# EAGLE design FuenteDePoder (EAGLE 8.6.3)
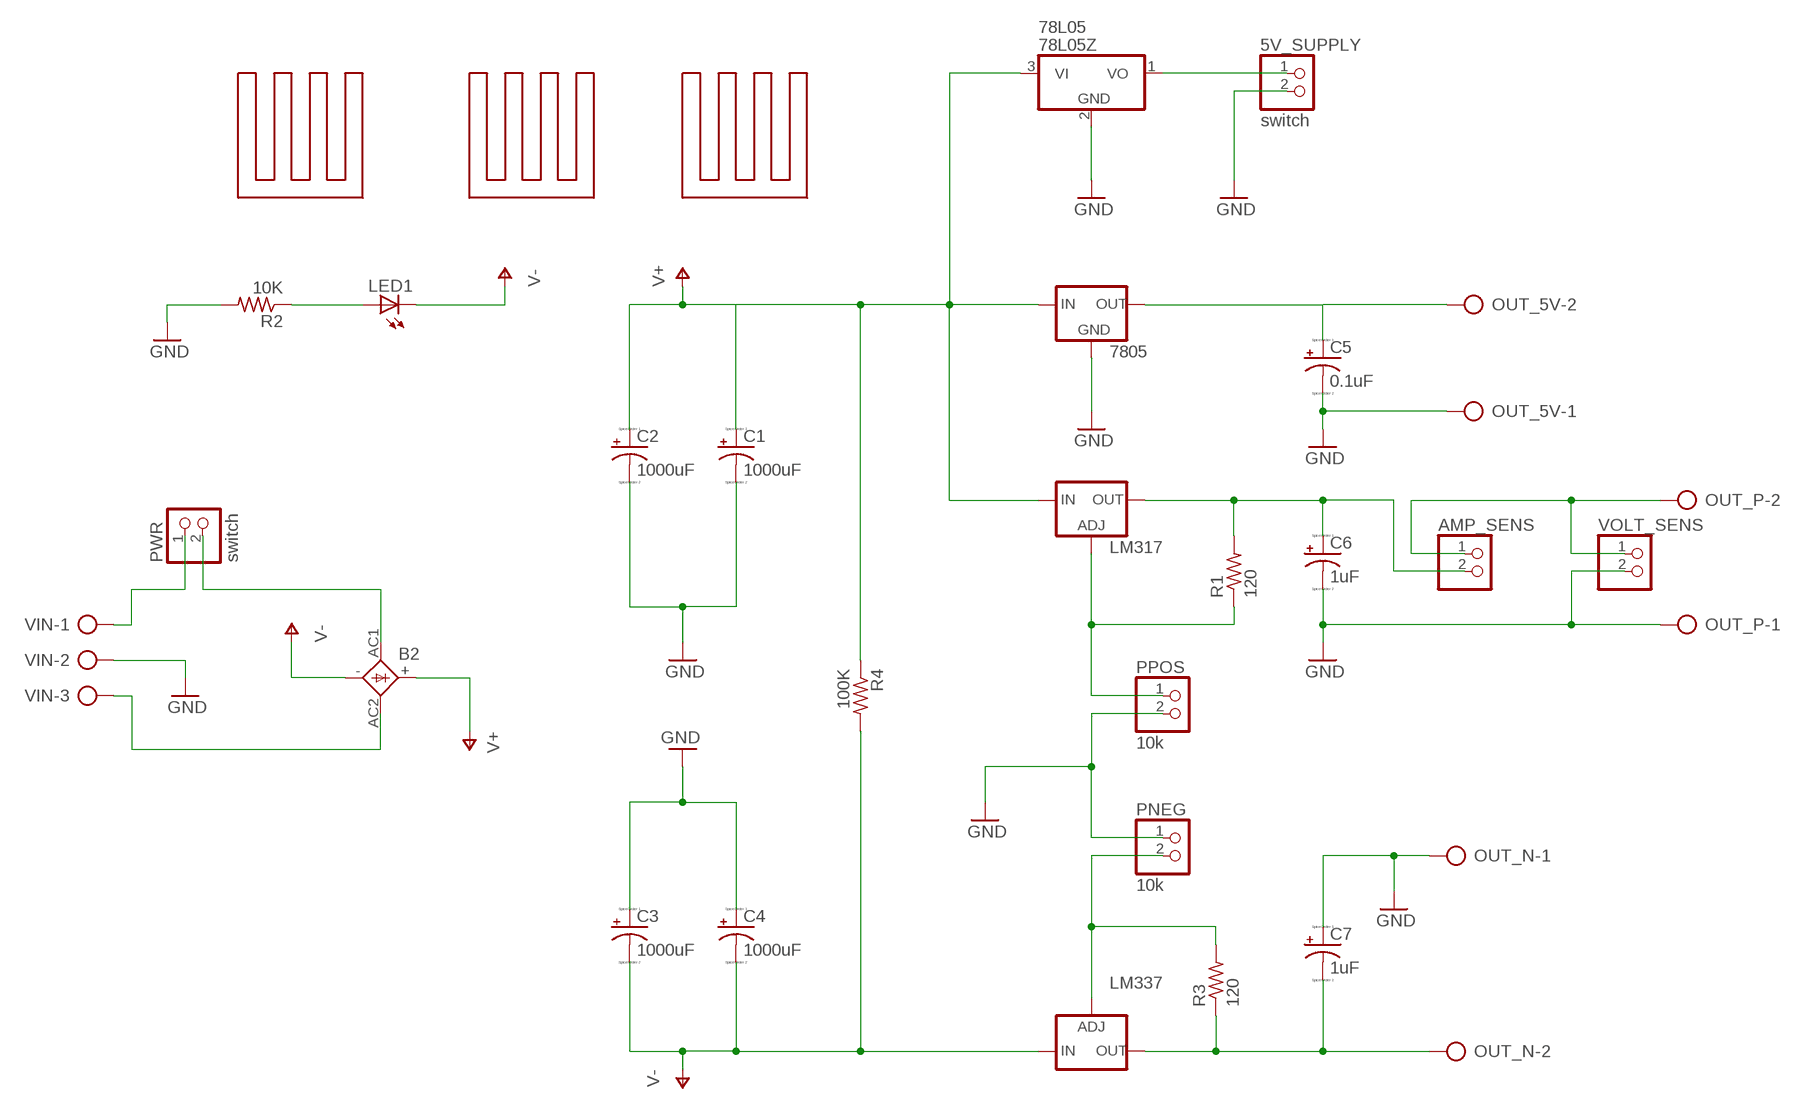
[diagram p0: schematic, sheet 1]

## Parts
5V_SUPPLY  switch  PINHD-1X2  [1X02]
78L05  78L05Z  [TO92]
7805  78XXS  [78XXS]
AMP_SENS  PINHD-1X2  [1X02]
B2  GBPC6  [GBPC6]
C1  1000uF  CPOL-USE3.5-10  [E3,5-10]
C2  1000uF  CPOL-USE3.5-10  [E3,5-10]
C3  1000uF  CPOL-USE3.5-10  [E3,5-10]
C4  1000uF  CPOL-USE3.5-10  [E3,5-10]
C5  0.1uF  CPOL-USE1.8-4  [E1,8-4]
C6  1uF  CPOL-USE1.8-4  [E1,8-4]
C7  1uF  CPOL-USE1.8-4  [E1,8-4]
LED1  LED5MM  [LED5MM]
LM317  LM317TS  [317TS]
LM337  LM337TS  [337TS]
OUT_5V  AK300/2  [AK300/2]
OUT_N  AK300/2  [AK300/2]
OUT_P  AK300/2  [AK300/2]
PNEG  10k  PINHD-1X2  [1X02]
PPOS  10k  PINHD-1X2  [1X02]
PWR  switch  PINHD-1X2  [1X02]
R1  120  R-US_0204/7  [0204/7]
R2  10K  R-US_0204/7  [0204/7]
R3  120  R-US_0204/7  [0204/7]
R4  100K  R-US_0204/7  [0204/7]
U$1  HEATSINK  [HEATSINK]
U$2  HEATSINK  [HEATSINK]
U$3  HEATSINK  [HEATSINK]
VIN  AK300/3  [AK300/3]
VOLT_SENS  PINHD-1X2  [1X02]

## Nets
GND: 5V_SUPPLY.2 78L05.2(GND) 7805.GND C1.- C2.- C3.+ C4.+ C5.- C6.- C7.+ OUT_5V.1 OUT_N.1 OUT_P.1 PNEG.1 PPOS.2 R2.2 VIN.2 VOLT_SENS.2
N$1: B2.AC1 PWR.2
N$2: B2.AC2 VIN.3
N$3: LED1.A R2.1
N$4: C7.- LM337.3(OUT) OUT_N.2 R3.1
N$5: 5V_SUPPLY.1 78L05.1(VO)
N$6: LM337.1(ADJ) PNEG.2 R3.2
N$7: LM317.1(ADJ) PPOS.1 R1.1
N$8: PWR.1 VIN.1
N$10: AMP_SENS.1 OUT_P.2 VOLT_SENS.1
V5: 7805.OUT C5.+ OUT_5V.2
V12: AMP_SENS.2 C6.+ LM317.2(OUT) R1.2
V+: 78L05.3(VI) 7805.IN B2.+ C1.+ C2.+ LM317.3(IN) R4.1
V-: B2.- C3.- C4.- LED1.K(C) LM337.2(IN) R4.2

## Library data of the parts
5V_SUPPLY AMP_SENS PNEG PPOS PWR VOLT_SENS = pinhead:PINHD-1X2: PIN HEADER
78L05 = linear:78*: Positive VOLTAGE REGULATOR Source: http://cache.national.com/ds/LM/LM78L05.pdf http://www.fairchildsemi.com/ds/LM/LM7805.pdf
7805 = v-reg:78XXS: VOLTAGE REGULATOR
B2 = rectifier:GBPC6: GENERAL INSTRUMENT RECTIFIER
C1-C7 = resistor:CPOL-US: POLARIZED CAPACITOR, American symbol
LED1 = led:LED: LED OSRAM: - CHIPLED LG R971, LG N971, LY N971, LG Q971, LY Q971, LO R971, LY R971 LH N974, LH R974 LS Q976, LO Q976, LY Q976 LO Q996 - Hyper CHIPLED LW Q18S LB Q993, LB Q99A, LB R99A - SideLED LS A670, LO A670, LY A670, LG A670, LP A670 LB A673, LV A673, LT A673, LW A673 LH A674 LY A675 LS A676, LA A676, LO A676, LY A676, LW A676 LS A679, LY A679, LG A679 - Hyper Micro SIDELED® LS Y876, LA Y876, LO Y876, LY Y876 LT Y87S - SmartLED LW L88C, LW L88S LB L89C, LB L89S, LG L890 LS L89K, LO L89K, LY L89K LS L896, LA L896, LO L896, LY L896 - TOPLED LS T670, LO T670, LY T670, LG T670, LP T670 LSG T670, LSP T670, LSY T670, LOP T670, LYG T670 LG T671, LOG T671, LSG T671 LB T673, LV T673, LT T673, LW T673 LH T674 LS T676, LA T676, LO T676, LY T676, LB T676, LH T676, LSB T676, LW T676 LB T67C, LV T67C, LT T67C, LS T67K, LO T67K, LY T67K, LW E67C LS E67B, LA E67B, LO E67B, LY E67B, LB E67C, LV E67C, LT E67C LW T67C LS T679, LY T679, LG T679 LS T770, LO T770, LY T770, LG T770, LP T770 LB T773, LV T773, LT T773, LW T773 LH T774 LS E675, LA E675, LY E675, LS T675 LS T776, LA T776, LO T776, LY T776, LB T776 LHGB T686 LT T68C, LB T68C - Hyper Mini TOPLED® LB M676 - Mini TOPLED Santana® LG M470 LS M47K, LO M47K, LY M47K Source: http://www.osram.convergy.de LUXEON: - LUMILED® LXK2-PW12-R00, LXK2-PW12-S00, LXK2-PW14-U00, LXK2-PW14-V00 LXK2-PM12-R00, LXK2-PM12-S00, LXK2-PM14-U00 LXK2-PE12-Q00, LXK2-PE12-R00, LXK2-PE12-S00, LXK2-PE14-T00, LXK2-PE14-U00 LXK2-PB12-K00, LXK2-PB12-L00, LXK2-PB12-M00, LXK2-PB14-N00, LXK2-PB14-P00, LXK2-PB14-Q00 LXK2-PR12-L00, LXK2-PR12-M00, LXK2-PR14-Q00, LXK2-PR14-R00 LXK2-PD12-Q00, LXK2-PD12-R00, LXK2-PD12-S00 LXK2-PH12-R00, LXK2-PH12-S00 LXK2-PL12-P00, LXK2-PL12-Q00, LXK2-PL12-R00 Source: www.luxeon.com KINGBRIGHT: KA-3528ASYC Source: www.kingbright.com
LM317 = v-reg:LM317TS: VOLTAGE REGULATOR
LM337 = v-reg:LM337TS: VOLTAGE REGULATOR
OUT_5V OUT_N OUT_P = con-ptr500:AK300/2: CONNECTOR; OC_FARNELL: unknown; OC_NEWARK: unknown
R1-R4 = resistor:R-US_: RESISTOR, American symbol
U$1-U$3 = E-Lab:HEATSINK
VIN = con-ptr500:AK300/3: CONNECTOR; OC_FARNELL: unknown; OC_NEWARK: unknown

## Board
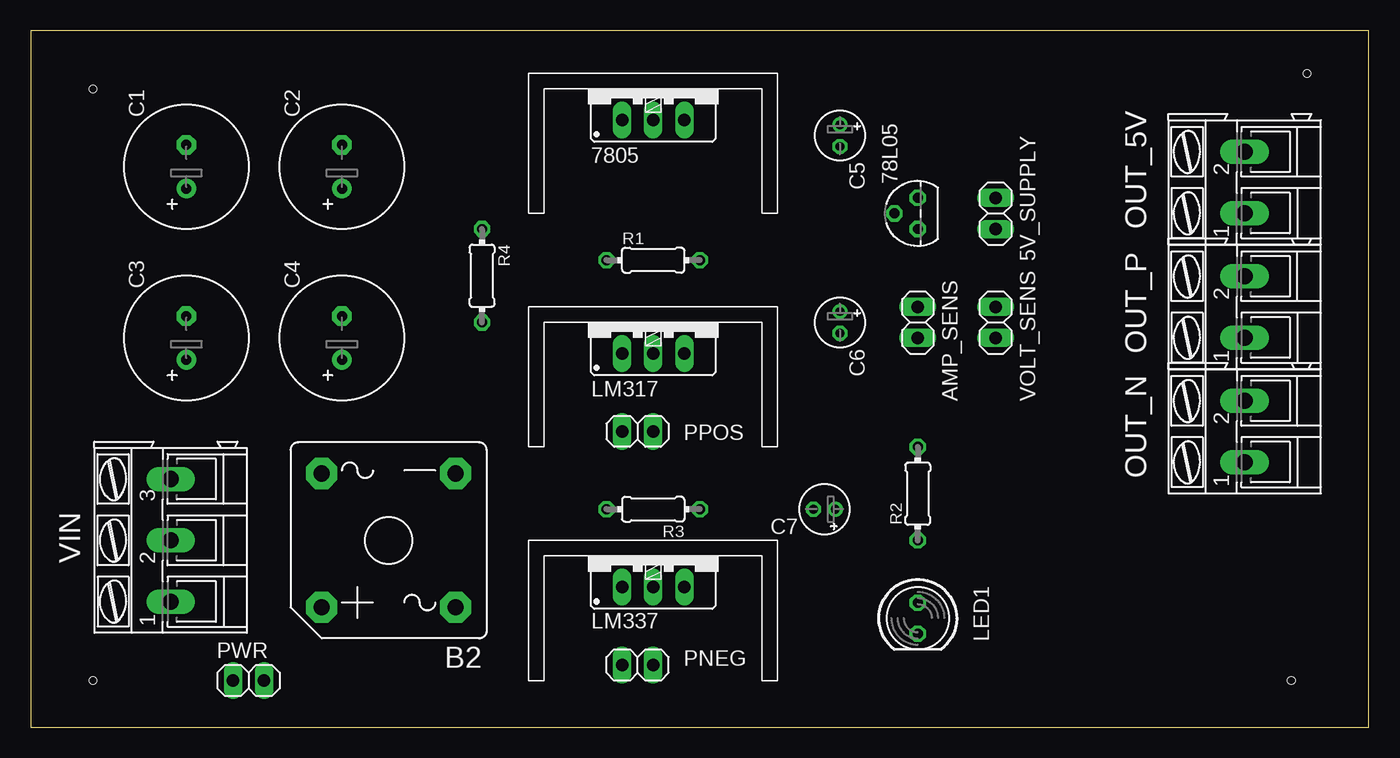
[diagram p1: board, top side]
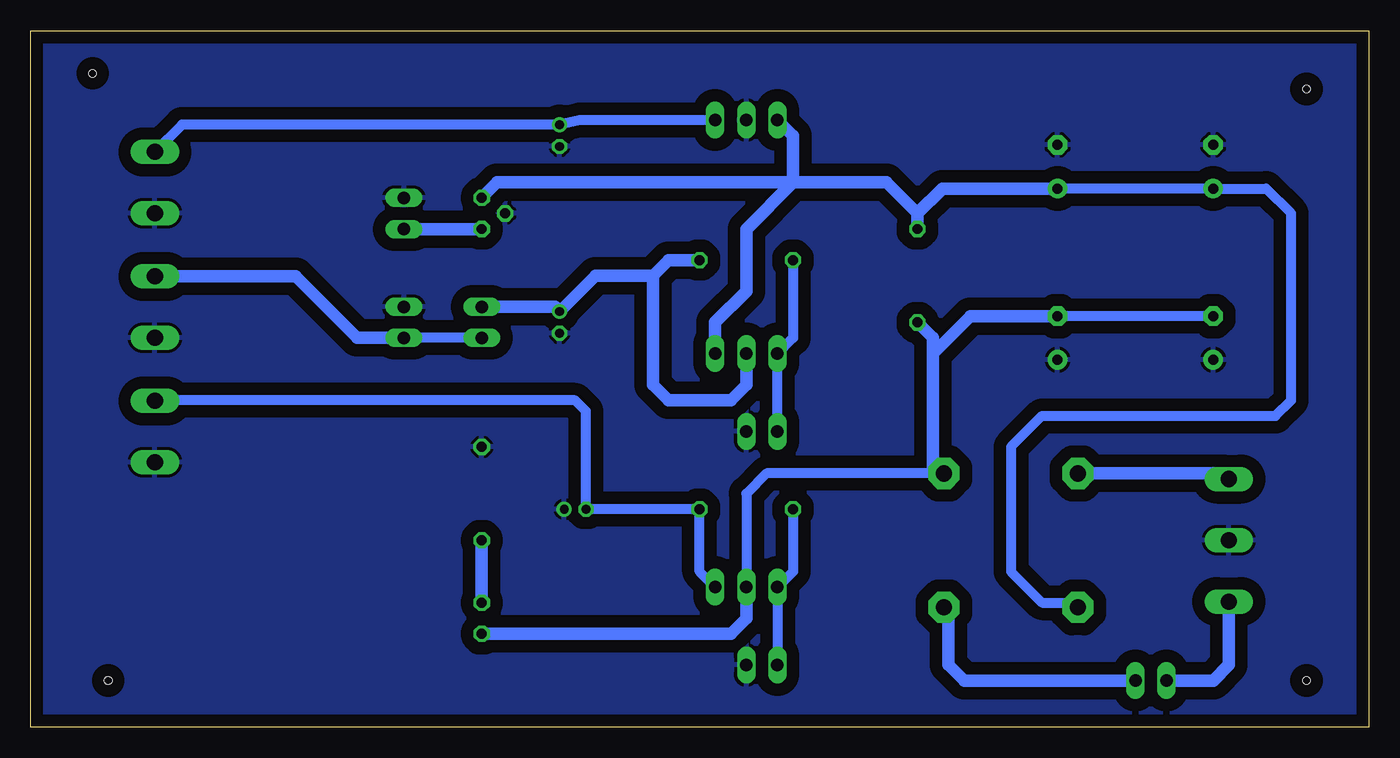
[diagram p2: board, bottom side, seen from below]

Size 109.2 x 56.82 mm. Coordinates in mm from the lower left corner, seen from the top.
Outline: 0,0 109.2,0 109.2,56.82 0,56.82 0,0
Copper layers (1*16): Top 0.035mm / dielectric 1.5mm / Bottom 0.035mm
Design rules "default *": minimum track width 1mm, minimum drill 0.5mm, track to track 0.5mm, track to pad 8mil, pad to pad 8mil, via to via 8mil, smd to smd 8mil, copper to edge 1mm, drill to drill 8mil, minimum pad ring 10mil, minimum via ring 8mil, stop-mask expansion 4mil, vias tented up to drill 0mil, thermal gap 10mil
Holes 0.6 mm at 5.08,3.81 5.08,52.07 104.14,53.34 102.87,3.81

### Footprints (pad centres in the part's own frame; a part is rotated, then mirrored left to right if it is on the bottom)
1X02 = drill 1.016 long: 1 -1.27,0; 2 1.27,0
TO92 = drill 0.813 octagon: 1 -1.27,0; 2 0,1.905; 3 1.27,0
78XXS = drill 1.016 long: GND 0,-2.54; IN -2.54,-2.54; OUT 2.54,-2.54
GBPC6 = drill 1.321 pad 2.54 octagon: + 5.461,5.461; - -5.461,-5.461; AC1 -5.461,5.461; AC2 5.461,-5.461
E3,5-10 = drill 0.813 pad 1.6: + -1.778,0 | drill 0.813 pad 1.6 octagon: - 1.778,0
E1,8-4 = drill 0.711 pad 1.168: + -0.889,0 | drill 0.711 pad 1.168 octagon: - 0.889,0
LED5MM = drill 0.813 octagon: A -1.27,0; K 1.27,0
317TS = drill 1.016 long: 1 -2.54,-2.54; 2 0,-2.54; 3 2.54,-2.54
337TS = drill 1.016 long: 1 -2.54,-2.54; 2 0,-2.54; 3 2.54,-2.54
AK300/2 = drill 1.321 long: 1 -2.515,0; 2 2.489,0
0204/7 = drill 0.813 octagon: 1 -3.81,0; 2 3.81,0
AK300/3 = drill 1.321 long: 1 -5.004,0; 2 0,0; 3 5.004,0

### Placement (x,y rotation side)
5V_SUPPLY  78.74,41.91 90 top
78L05  72.39,41.91 90 top
7805  50.8,52.07 0 top
AMP_SENS  72.39,33.02 90 top
B2  29.21,15.24 180 top
C1  12.7,45.72 90 top
C2  25.4,45.72 90 top
C3  12.7,31.75 90 top
C4  25.4,31.75 90 top
C5  66.04,48.26 270 top
C6  66.04,33.02 270 top
C7  64.77,17.78 180 top
LED1  72.39,8.89 270 top
LM317  50.8,33.02 0 top
LM337  50.8,13.97 0 top
OUT_5V  99.06,44.45 90 top
OUT_N  99.06,24.13 90 top
OUT_P  99.06,34.29 90 top
PNEG  49.53,5.08 180 top
PPOS  49.53,24.13 0 top
PWR  17.78,3.81 0 top
R1  50.8,38.1 0 top
R2  72.39,19.05 90 top
R3  50.8,17.78 180 top
R4  36.83,36.83 270 top
U$1  50.8,13.97 180 top
U$2  50.8,33.02 180 top
U$3  50.8,52.07 180 top
VIN  11.43,15.24 90 top
VOLT_SENS  78.74,33.02 90 top

### Tracks (layer width: path | path; a pad name or v marks a point on that pad's centre or on a via)
GND
  pour Bottom (isolate 1.016): 0,0 0,57.15 109.22,57.15 109.22,0
N$1
  Bottom 1.016: PWR.2 33.02,3.81 34.29,5.08 34.29,9.4 B2.AC1
N$2
  Bottom 0.813: 23.29,20.24 B2.AC2
  Bottom 1.016: VIN.3 11.89,20.7 B2.AC2
N$3
  Bottom 1.016: LED1.A R2.1
N$4
  Bottom 0.813: LM337.3 54.61,12.7 R3.1 C7.- 63.88,25.78 64.77,26.67 100.28,26.67 OUT_N.2
N$5
  Bottom 1.016: 5V_SUPPLY.1 78L05.1
N$6
  Bottom 0.813: PNEG.2 LM337.1 46.99,12.7 R3.2
N$7
  Bottom 0.813: R1.1 46.99,31.75 LM317.1 PPOS.1
N$8
  Bottom 1.016: VIN.1 11.43,5.08 12.7,3.81 PWR.1
N$10
  Bottom 0.813: AMP_SENS.1 VOLT_SENS.1
  Bottom 1.016: OUT_P.2 87.58,36.78 82.55,31.75 VOLT_SENS.1
V5
  Bottom 0.813: 7805.OUT 64.39,49.53 C5.+ 96.85,49.15 OUT_5V.2
V12
  Bottom 1.016: AMP_SENS.2 66.42,34.29 C6.+ 63.12,36.83 58.42,36.83 | R1.2 57.15,38.1 58.42,36.83 | 58.42,36.83 58.42,27.94 57.15,26.67 52.07,26.67 50.8,27.94 LM317.2
V+
  Bottom 0.813: C2.+ C1.+ 8.38,43.94 6.35,41.91 6.35,26.67 7.62,25.4 26.67,25.4 29.21,22.86 29.21,12.7 26.67,10.16 24.13,10.16 B2.+
  Bottom 1.016: C2.+ 34.8,43.94 36.83,41.91 | 36.83,41.91 R4.1 | 78L05.3 71.12,44.45 46.99,44.45 | LM317.3 53.34,33.02 50.8,35.56 50.8,40.64 46.99,44.45 | 46.99,44.45 39.37,44.45 36.83,41.91 | 7805.IN 46.99,48.26 46.99,44.45
V-
  Bottom 0.813: C3.- C4.- | B2.- 35.56,20.7 49.15,20.7 50.8,19.05 LM337.2
  Bottom 1.016: C4.- 32.51,33.53 35.56,30.48 | 35.56,30.48 35.56,20.7 | R4.2 35.56,31.75 35.56,30.48 | LM337.2 50.8,8.89 52.07,7.62 LED1.K